# EAGLE schematic Buffered mult rev 1 (EAGLE 7.5.0)
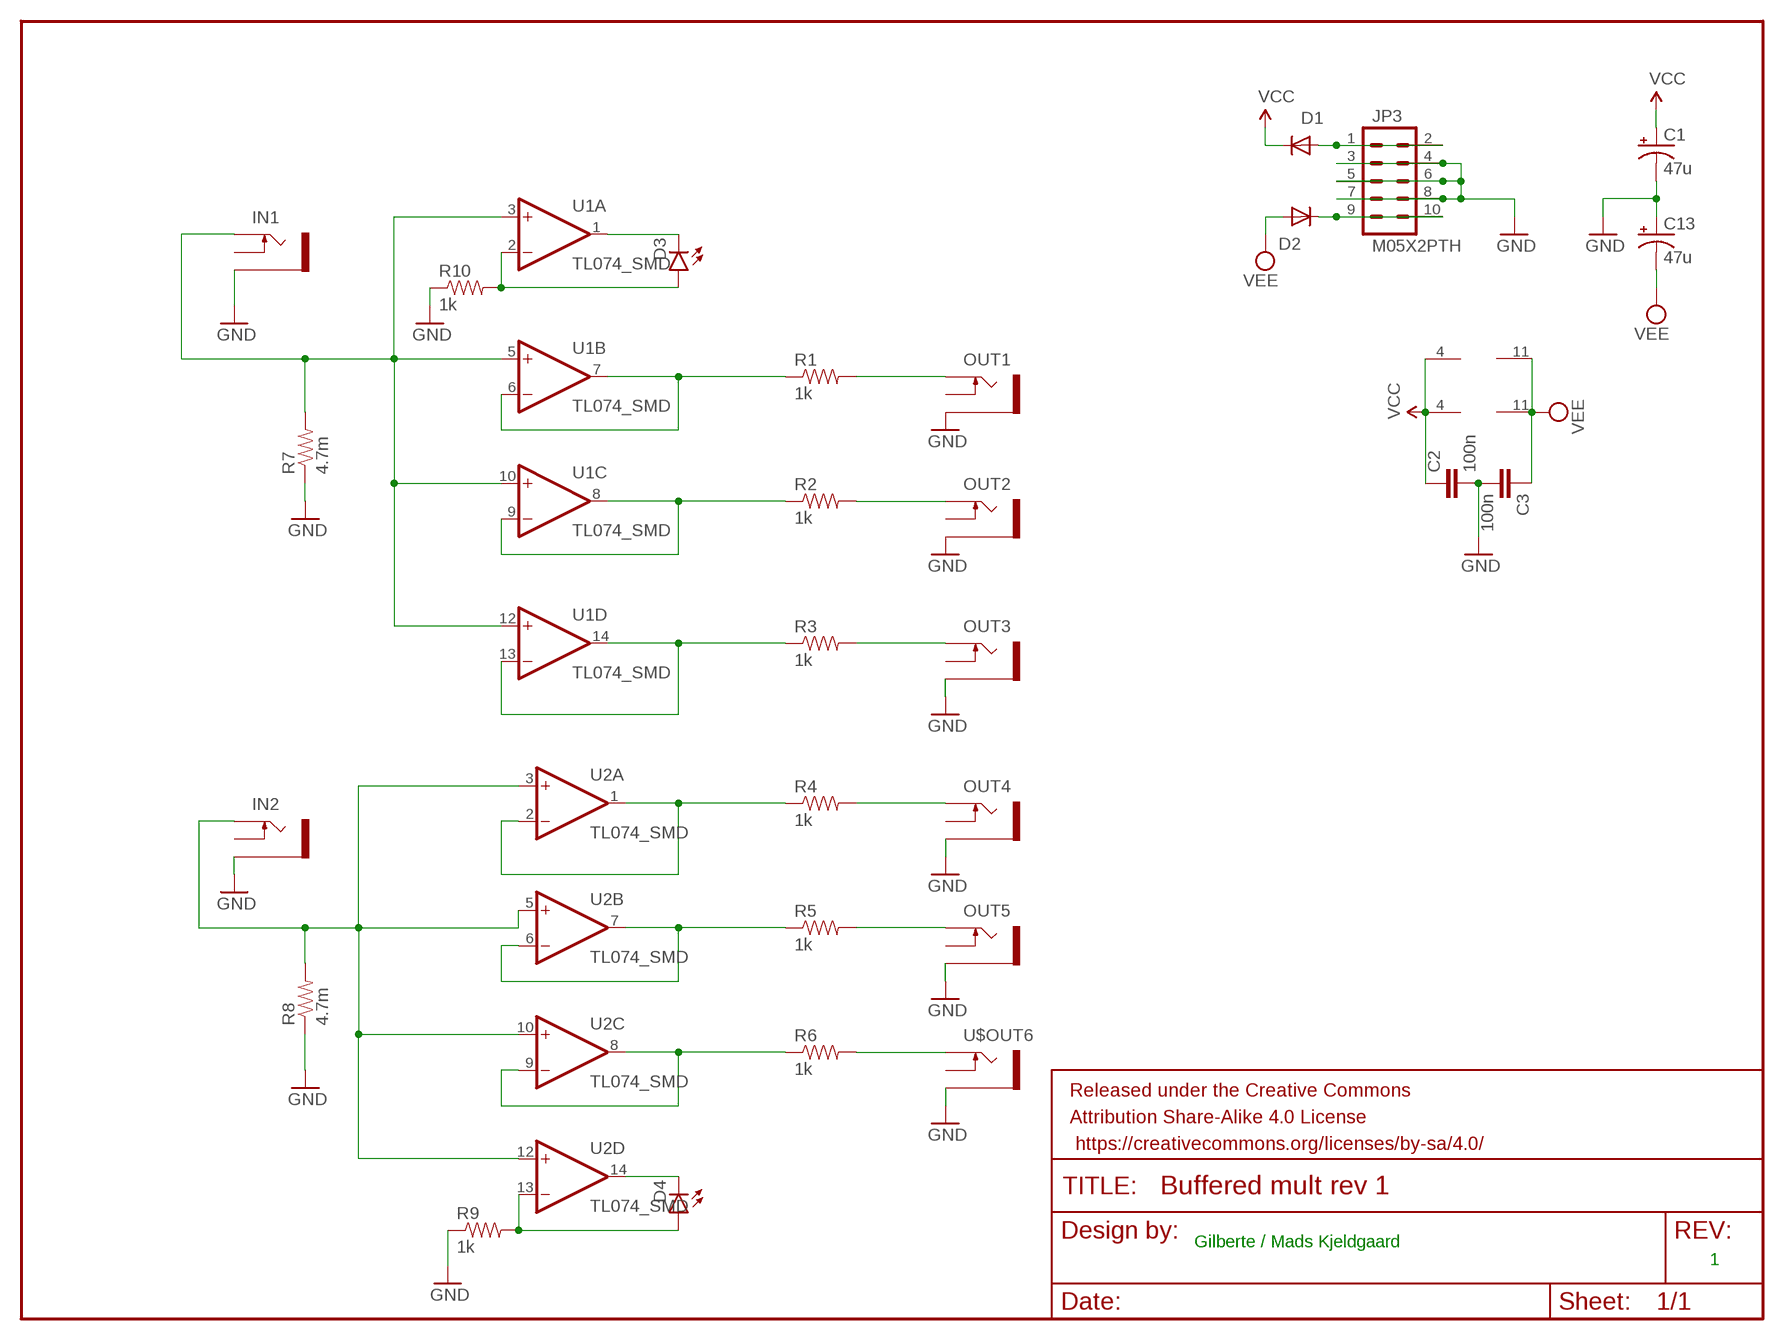
[diagram p0: schematic, sheet 1]

## Parts
C1  47u  CPOL-USD  [PANASONIC_D]
C2  100n  CAP1206  [1206]
C3  100n  CAP1206  [1206]
C13  47u  CPOL-USD  [PANASONIC_D]
D1  1N5819HW  DIODE-SOD123  [SOD123]
D2  1N5819HW  DIODE-SOD123  [SOD123]
D3  LED3MM  [LED3MM]
D4  LED3MM  [LED3MM]
FRAME1  FRAME-LETTER  [CREATIVE_COMMONS]
IN1  THONKICONNOLD  [THONKICONN]
IN2  THONKICONNOLD  [THONKICONN]
JP3  M05X2PTH  [AVR_ICSP]
OUT1  THONKICONNOLD  [THONKICONN]
OUT2  THONKICONNOLD  [THONKICONN]
OUT3  THONKICONNOLD  [THONKICONN]
OUT4  THONKICONNOLD  [THONKICONN]
OUT5  THONKICONNOLD  [THONKICONN]
R1  1k  RESISTOR1206  [1206]
R2  1k  RESISTOR1206  [1206]
R3  1k  RESISTOR1206  [1206]
R4  1k  RESISTOR1206  [1206]
R5  1k  RESISTOR1206  [1206]
R6  1k  RESISTOR1206  [1206]
R7  4.7m  RESISTOR1206  [1206]
R8  4.7m  RESISTOR1206  [1206]
R9  1k  RESISTOR1206  [1206]
R10  1k  RESISTOR1206  [1206]
U1  TL074_SMD  [SO14]
U2  TL074_SMD  [SO14]
U$OUT6  THONKICONNOLD  [THONKICONN]

## Nets
GND: C1.- C2.2 C3.2 C13.+ IN1.P$1_SLEEVE(SLEEVE) IN2.P$1_SLEEVE(SLEEVE) JP3.3 JP3.4 JP3.5 JP3.6 JP3.7 JP3.8 OUT1.P$1_SLEEVE(SLEEVE) OUT2.P$1_SLEEVE(SLEEVE) OUT3.P$1_SLEEVE(SLEEVE) OUT4.P$1_SLEEVE(SLEEVE) OUT5.P$1_SLEEVE(SLEEVE) R7.1 R8.1 R9.1 R10.1 U$OUT6.P$1_SLEEVE(SLEEVE)
N$1: R6.2 U$OUT6.P$3_TIP(TIP)
N$2: R3.1 U1.13(D:-IN) U1.14(D:OUT)
N$3: OUT5.P$3_TIP(TIP) R5.2
N$4: OUT4.P$3_TIP(TIP) R4.2
N$5: IN1.P$3_TIP(TIP) R7.2 U1.3(A:+IN) U1.5(B:+IN) U1.10(C:+IN) U1.12(D:+IN)
N$6: R2.1 U1.8(C:OUT) U1.9(C:-IN)
N$7: OUT1.P$3_TIP(TIP) R1.2
N$8: OUT2.P$3_TIP(TIP) R2.2
N$9: OUT3.P$3_TIP(TIP) R3.2
N$10: R1.1 U1.6(B:-IN) U1.7(B:OUT)
N$11: IN2.P$3_TIP(TIP) R8.2 U2.3(A:+IN) U2.5(B:+IN) U2.10(C:+IN) U2.12(D:+IN)
N$13: R5.1 U2.6(B:-IN) U2.7(B:OUT)
N$14: R6.1 U2.8(C:OUT) U2.9(C:-IN)
N$15: D4.K(C) U2.14(D:OUT)
N$16: D4.A R9.2 U2.13(D:-IN)
N$17: R4.1 U2.1(A:OUT) U2.2(A:-IN)
N$19: D3.K(C) U1.1(A:OUT)
N$20: D3.A R10.2 U1.2(A:-IN)
N$56: D1.A JP3.1 JP3.2
N$64: D2.C JP3.9 JP3.10
VCC: C1.+ C2.1 D1.C U1.4(P:V+) U2.4(P:V+)
VEE: C3.1 C13.- D2.A U1.11(P:V-) U2.11(P:V-)
Unconnected: IN1.P$2_SWITCH(SWITCH) IN2.P$2_SWITCH(SWITCH) OUT1.P$2_SWITCH(SWITCH) OUT2.P$2_SWITCH(SWITCH) OUT3.P$2_SWITCH(SWITCH) OUT4.P$2_SWITCH(SWITCH) OUT5.P$2_SWITCH(SWITCH) U$OUT6.P$2_SWITCH(SWITCH)

## Notes on the sheet
- Gilberte / Mads Kjeldgaard
- 1

## Library data of the parts
C1 C13 = rcl:CPOL-US: POLARIZED CAPACITOR, American symbol
C2 C3 = SparkFun-Capacitors:CAP: Capacitor Standard 0603 ceramic capacitor, and 0.1" leaded capacitor.
D1 D2 = diode:DIODE-: DIODE
D3 D4 = SparkFun-LED:LED: LEDs Standard schematic elements and footprints for 5mm, 3mm, 1206, and 0603 sized LEDs. 5mm - Spark Fun Electronics SKU : COM-00529 (and others); PROD_ID: DIO-08794
FRAME1 = SparkFun-Aesthetics:FRAME-LETTER: Schematic Frame Standard 8.5x11 US Letter frame
IN1 IN2 OUT1-OUT5 U$OUT6 = MusicThingModular:THONKICONN: 3.5mm socket for Eurorack modular synths
JP3 = og-header:M05X2: Header 5x2 Standard 10-pin dual row 0.1" header. Commonly used with AVR-ISP. Use with Spark Fun Electronics SKU: PRT-00778
R1-R10 = SparkFun-Passives:RESISTOR: Resistor Basic schematic elements and footprints for 0603, 1206, and PTH resistors.
U1 U2 = MusicThingModular:TL074: Generic Quad Op Amp